# Altium schematic sheet Undervoltage Protection.SchDoc
size A
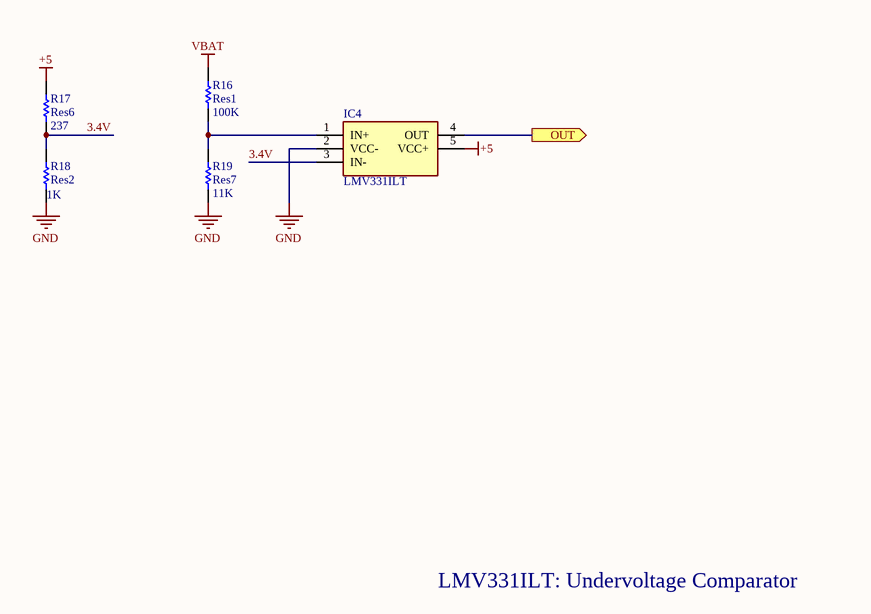
[diagram p0: Undervoltage Protection.SchDoc]

## Parts
IC4  LMV331ILT  [SOT95P280X145-5N]
R16  Res1  value 100K  [0402]
R17  Res6  value 237  [0402]
R18  Res2  value 1K  [0402]
R19  Res7  value 11K  [0402]

## Ports
OUT (out)

## Nets
+5: IC4.5(VCC+) R17.1
GND: IC4.2(VCC-) R18.1 R19.1
VBAT: R16.2
3.4V: IC4.3(IN-) R17.2 R18.2
OUT: IC4.4(OUT) ; port OUT
NetIC4_1: IC4.1(IN+) R16.1 R19.2

## Notes on the sheet
- LMV331ILT: Undervoltage Comparator

## Library data of the parts
IC4 = LMV331ILT: Integrated Circuit; Manufacturer_Name: STMicroelectronics; Datasheet Link: http://www.farnell.com/datasheets/2042663.pdf; Height: 1.45mm; Manufacturer_Part_Number: LMV331ILT; Mouser Part Number: 511-LMV331ILT; Mouser Price/Stock: https://www.mouser.com/Search/Refine.aspx?Keyword=511-LMV331ILT
R16-R19 = Res1: Resistor; Published: 8-Jun-2000; LatestRevisionDate: 17-Jul-2002; LatestRevisionNote: Re-released for DXP Platform.; PackageReference: AXIAL-0.3; Publisher: Altium Limited; PackageDescription: Axial Device, Thru-Hole; 2 Leads; 0.3 in Pin Spacing